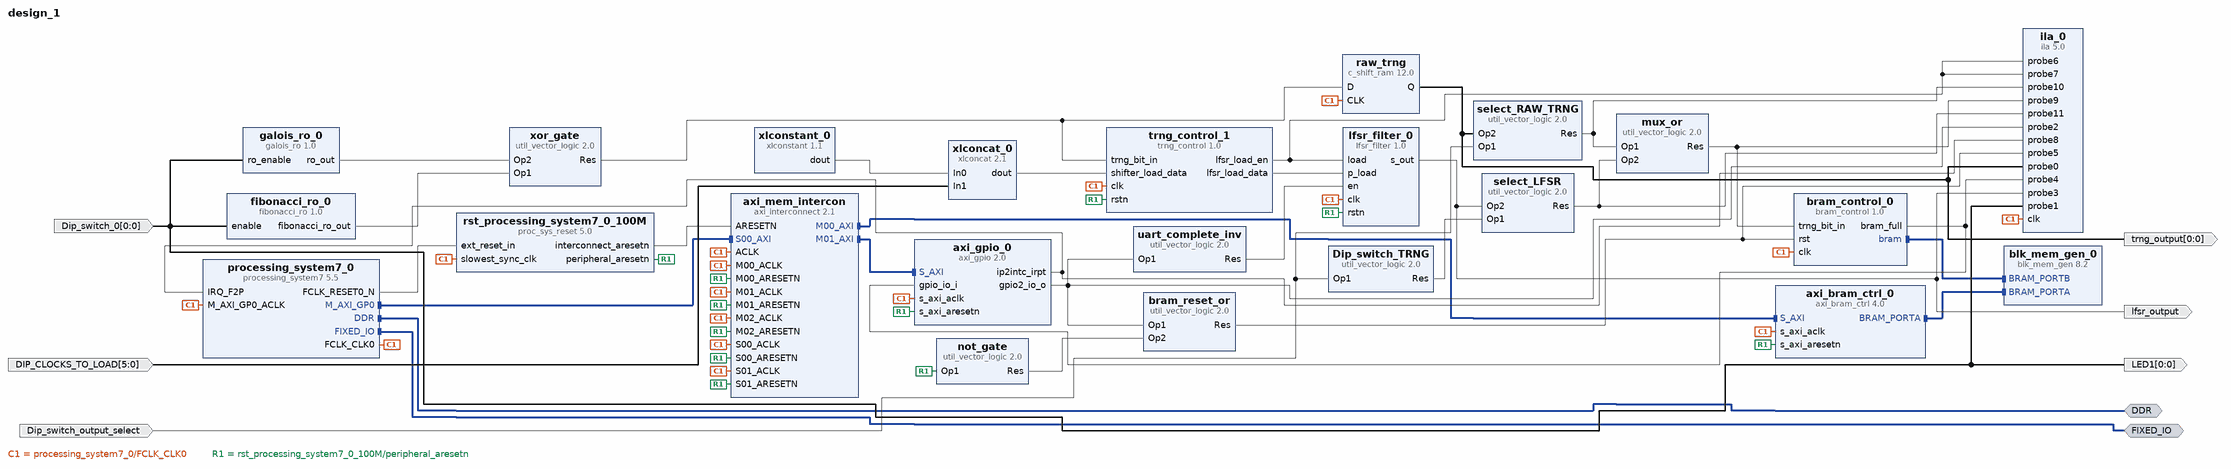
[diagram p0: block diagram of the top level]
# Vivado block design design_1, Vivado 2014.4
create_bd_design design_1

create_bd_intf_port -mode Master -vlnv xilinx.com:interface:ddrx_rtl:1.0 DDR
create_bd_intf_port -mode Master -vlnv xilinx.com:display_processing_system7:fixedio_rtl:1.0 FIXED_IO
create_bd_port -dir O -from 0 -to 0 -type data trng_output
create_bd_port -dir I -from 0 -to 0 Dip_switch_0
create_bd_port -dir O -from 0 -to 0 LED1
create_bd_port -dir I Dip_switch_output_select
create_bd_port -dir O lfsr_output
create_bd_port -dir I -from 5 -to 0 DIP_CLOCKS_TO_LOAD

create_bd_cell -type ip -vlnv xilinx.com:ip:processing_system7:5.5 processing_system7_0
set_property -dict [list \
  CONFIG.PCW_FPGA0_PERIPHERAL_FREQMHZ 100.000000 \
  CONFIG.PCW_USE_FABRIC_INTERRUPT 1 \
  CONFIG.PCW_IRQ_F2P_INTR 1 \
  CONFIG.preset {ZedBoard*} \
] [get_bd_cells processing_system7_0]
create_bd_cell -type ip -vlnv xilinx.com:ip:axi_interconnect:2.1 axi_mem_intercon
set_property -dict {CONFIG.NUM_SI 2 CONFIG.NUM_MI 3} [get_bd_cells axi_mem_intercon]
create_bd_cell -type ip -vlnv xilinx.com:ip:proc_sys_reset:5.0 rst_processing_system7_0_100M
create_bd_cell -type ip -vlnv user.org:user:lfsr_filter:1.0 lfsr_filter_0
create_bd_cell -type ip -vlnv user.org:user:bram_control:1.0 bram_control_0
set_property -dict {CONFIG.BRAM_DEPTH 2048} [get_bd_cells bram_control_0]
create_bd_cell -type ip -vlnv xilinx.com:ip:util_vector_logic:2.0 not_gate
set_property -dict {CONFIG.C_SIZE 1 CONFIG.C_OPERATION not} [get_bd_cells not_gate]
create_bd_cell -type ip -vlnv xilinx.com:ip:util_vector_logic:2.0 xor_gate
set_property -dict {CONFIG.C_SIZE 1 CONFIG.C_OPERATION xor} [get_bd_cells xor_gate]
create_bd_cell -type ip -vlnv xilinx.com:ip:axi_gpio:2.0 axi_gpio_0
set_property -dict [list \
  CONFIG.C_GPIO_WIDTH 1 \
  CONFIG.C_GPIO2_WIDTH 1 \
  CONFIG.C_IS_DUAL 1 \
  CONFIG.C_ALL_INPUTS 1 \
  CONFIG.C_DOUT_DEFAULT_2 0x00000000 \
  CONFIG.C_INTERRUPT_PRESENT 1 \
  CONFIG.C_ALL_OUTPUTS_2 1 \
] [get_bd_cells axi_gpio_0]
create_bd_cell -type ip -vlnv xilinx.com:ip:c_shift_ram:12.0 raw_trng
set_property -dict {CONFIG.Width 1 CONFIG.Depth 1 CONFIG.DefaultData 0 CONFIG.AsyncInitVal 0} [get_bd_cells raw_trng]
create_bd_cell -type ip -vlnv xilinx.com:ip:ila:5.0 ila_0
set_property -dict [list \
  CONFIG.C_PROBE12_WIDTH 1 \
  CONFIG.C_PROBE7_WIDTH 1 \
  CONFIG.C_NUM_OF_PROBES 12 \
  CONFIG.C_EN_STRG_QUAL 1 \
  CONFIG.C_INPUT_PIPE_STAGES 2 \
  CONFIG.C_ADV_TRIGGER true \
  CONFIG.C_PROBE14_MU_CNT 2 \
  CONFIG.C_PROBE13_MU_CNT 2 \
  CONFIG.C_PROBE12_MU_CNT 2 \
  CONFIG.C_PROBE11_MU_CNT 2 \
  CONFIG.C_PROBE10_MU_CNT 2 \
  CONFIG.C_PROBE9_MU_CNT 2 \
  CONFIG.C_PROBE8_MU_CNT 2 \
  CONFIG.C_PROBE7_MU_CNT 2 \
  CONFIG.C_PROBE6_MU_CNT 2 \
  CONFIG.C_PROBE5_MU_CNT 2 \
  CONFIG.C_PROBE4_MU_CNT 2 \
  CONFIG.C_PROBE3_MU_CNT 2 \
  CONFIG.C_PROBE2_MU_CNT 2 \
  CONFIG.C_PROBE1_MU_CNT 2 \
  CONFIG.C_PROBE0_MU_CNT 2 \
  CONFIG.ALL_PROBE_SAME_MU_CNT 2 \
  CONFIG.C_ENABLE_ILA_AXI_MON false \
  CONFIG.C_MONITOR_TYPE Native \
] [get_bd_cells ila_0]
create_bd_cell -type ip -vlnv user.org:user:fibonacci_ro:1.0 fibonacci_ro_0
create_bd_cell -type ip -vlnv user.org:user:galois_ro:1.0 galois_ro_0
create_bd_cell -type ip -vlnv xilinx.com:ip:blk_mem_gen:8.2 blk_mem_gen_0
set_property -dict [list \
  CONFIG.Memory_Type True_Dual_Port_RAM \
  CONFIG.Enable_B Use_ENB_Pin \
  CONFIG.Use_RSTB_Pin true \
  CONFIG.Port_B_Clock 100 \
  CONFIG.Port_B_Write_Rate 50 \
  CONFIG.Port_B_Enable_Rate 100 \
] [get_bd_cells blk_mem_gen_0]
create_bd_cell -type ip -vlnv xilinx.com:ip:axi_bram_ctrl:4.0 axi_bram_ctrl_0
set_property -dict {CONFIG.SINGLE_PORT_BRAM 1} [get_bd_cells axi_bram_ctrl_0]
create_bd_cell -type ip -vlnv xilinx.com:ip:util_vector_logic:2.0 Dip_switch_TRNG
set_property -dict {CONFIG.C_SIZE 1 CONFIG.C_OPERATION not} [get_bd_cells Dip_switch_TRNG]
create_bd_cell -type ip -vlnv xilinx.com:ip:util_vector_logic:2.0 select_LFSR
set_property -dict {CONFIG.C_SIZE 1} [get_bd_cells select_LFSR]
create_bd_cell -type ip -vlnv xilinx.com:ip:util_vector_logic:2.0 select_RAW_TRNG
set_property -dict {CONFIG.C_SIZE 1} [get_bd_cells select_RAW_TRNG]
create_bd_cell -type ip -vlnv xilinx.com:ip:util_vector_logic:2.0 mux_or
set_property -dict {CONFIG.C_SIZE 1 CONFIG.C_OPERATION or} [get_bd_cells mux_or]
create_bd_cell -type ip -vlnv xilinx.com:ip:util_vector_logic:2.0 uart_complete_inv
set_property -dict {CONFIG.C_SIZE 1 CONFIG.C_OPERATION not} [get_bd_cells uart_complete_inv]
create_bd_cell -type ip -vlnv xilinx.com:ip:util_vector_logic:2.0 bram_reset_or
set_property -dict {CONFIG.C_SIZE 1 CONFIG.C_OPERATION or} [get_bd_cells bram_reset_or]
create_bd_cell -type ip -vlnv user.org:user:trng_control:1.0 trng_control_1
create_bd_cell -type ip -vlnv xilinx.com:ip:xlconstant:1.1 xlconstant_0
set_property -dict {CONFIG.CONST_WIDTH 10 CONFIG.CONST_VAL 1023} [get_bd_cells xlconstant_0]
create_bd_cell -type ip -vlnv xilinx.com:ip:xlconcat:2.1 xlconcat_0
set_property -dict {CONFIG.IN0_WIDTH 10 CONFIG.IN1_WIDTH 6} [get_bd_cells xlconcat_0]

# ---- connections ----

connect_bd_intf_net [get_bd_intf_pins processing_system7_0/M_AXI_GP0] [get_bd_intf_pins axi_mem_intercon/S00_AXI]
connect_bd_intf_net [get_bd_intf_pins axi_mem_intercon/M01_AXI] [get_bd_intf_pins axi_gpio_0/S_AXI]
connect_bd_intf_net [get_bd_intf_pins axi_bram_ctrl_0/BRAM_PORTA] [get_bd_intf_pins blk_mem_gen_0/BRAM_PORTA]
connect_bd_intf_net [get_bd_intf_pins bram_control_0/bram] [get_bd_intf_pins blk_mem_gen_0/BRAM_PORTB]
connect_bd_intf_net [get_bd_intf_pins axi_mem_intercon/M00_AXI] [get_bd_intf_pins axi_bram_ctrl_0/S_AXI]
connect_bd_intf_net [get_bd_intf_ports DDR] [get_bd_intf_pins processing_system7_0/DDR]
connect_bd_intf_net [get_bd_intf_ports FIXED_IO] [get_bd_intf_pins processing_system7_0/FIXED_IO]
connect_bd_net [get_bd_pins processing_system7_0/FCLK_CLK0] \
  [get_bd_pins processing_system7_0/M_AXI_GP0_ACLK] [get_bd_pins rst_processing_system7_0_100M/slowest_sync_clk] \
  [get_bd_pins lfsr_filter_0/clk] [get_bd_pins bram_control_0/clk] [get_bd_pins axi_gpio_0/s_axi_aclk] \
  [get_bd_pins raw_trng/CLK] [get_bd_pins ila_0/clk] [get_bd_pins axi_bram_ctrl_0/s_axi_aclk] \
  [get_bd_pins axi_mem_intercon/S00_ACLK] [get_bd_pins axi_mem_intercon/ACLK] [get_bd_pins axi_mem_intercon/M00_ACLK] \
  [get_bd_pins axi_mem_intercon/M01_ACLK] [get_bd_pins axi_mem_intercon/M02_ACLK] [get_bd_pins axi_mem_intercon/S01_ACLK] \
  [get_bd_pins trng_control_1/clk]
connect_bd_net [get_bd_pins processing_system7_0/FCLK_RESET0_N] [get_bd_pins rst_processing_system7_0_100M/ext_reset_in]
connect_bd_net [get_bd_pins rst_processing_system7_0_100M/peripheral_aresetn] \
  [get_bd_pins lfsr_filter_0/rstn] [get_bd_pins not_gate/Op1] [get_bd_pins axi_gpio_0/s_axi_aresetn] \
  [get_bd_pins axi_bram_ctrl_0/s_axi_aresetn] [get_bd_pins axi_mem_intercon/S00_ARESETN] \
  [get_bd_pins axi_mem_intercon/M00_ARESETN] [get_bd_pins axi_mem_intercon/M01_ARESETN] \
  [get_bd_pins axi_mem_intercon/M02_ARESETN] [get_bd_pins axi_mem_intercon/S01_ARESETN] [get_bd_pins trng_control_1/rstn]
connect_bd_net [get_bd_pins rst_processing_system7_0_100M/interconnect_aresetn] [get_bd_pins axi_mem_intercon/ARESETN]
connect_bd_net [get_bd_pins xor_gate/Res] [get_bd_pins raw_trng/D] [get_bd_pins trng_control_1/trng_bit_in]
connect_bd_net -net trng_control_0_lfsr_load_en [get_bd_pins trng_control_1/lfsr_load_en] \
  [get_bd_pins lfsr_filter_0/load] [get_bd_pins ila_0/probe6] [get_bd_pins ila_0/probe7]
connect_bd_net [get_bd_pins bram_control_0/bram_full] [get_bd_pins axi_gpio_0/gpio_io_i] [get_bd_pins ila_0/probe4]
connect_bd_net [get_bd_pins axi_gpio_0/gpio2_io_o] [get_bd_pins ila_0/probe2] [get_bd_pins uart_complete_inv/Op1] [get_bd_pins bram_reset_or/Op1]
connect_bd_net [get_bd_pins axi_gpio_0/ip2intc_irpt] [get_bd_pins processing_system7_0/IRQ_F2P] [get_bd_pins ila_0/probe8]
connect_bd_net -net c_shift_ram_0_Q [get_bd_pins raw_trng/Q] [get_bd_ports trng_output] [get_bd_pins ila_0/probe0] [get_bd_pins select_RAW_TRNG/Op2]
connect_bd_net -net Op1_1 [get_bd_ports Dip_switch_0] \
  [get_bd_ports LED1] [get_bd_pins ila_0/probe1] [get_bd_pins galois_ro_0/ro_enable] [get_bd_pins fibonacci_ro_0/enable]
connect_bd_net [get_bd_pins fibonacci_ro_0/fibonacci_ro_out] [get_bd_pins xor_gate/Op1]
connect_bd_net [get_bd_pins galois_ro_0/ro_out] [get_bd_pins xor_gate/Op2]
connect_bd_net [get_bd_ports Dip_switch_output_select] [get_bd_pins Dip_switch_TRNG/Op1] [get_bd_pins select_RAW_TRNG/Op1]
connect_bd_net -net util_vector_logic_0_Res1 [get_bd_pins Dip_switch_TRNG/Res] [get_bd_pins select_LFSR/Op1]
connect_bd_net -net util_vector_logic_2_Res [get_bd_pins select_RAW_TRNG/Res] [get_bd_pins mux_or/Op1] [get_bd_pins ila_0/probe10]
connect_bd_net -net util_vector_logic_1_Res [get_bd_pins select_LFSR/Res] [get_bd_pins mux_or/Op2] [get_bd_pins ila_0/probe11]
connect_bd_net -net util_vector_logic_3_Res [get_bd_pins mux_or/Res] [get_bd_pins bram_control_0/trng_bit_in] [get_bd_pins ila_0/probe9]
connect_bd_net -net util_vector_logic_4_Res [get_bd_pins uart_complete_inv/Res] [get_bd_pins lfsr_filter_0/en]
connect_bd_net -net util_vector_logic_5_Res [get_bd_pins bram_reset_or/Res] [get_bd_pins bram_control_0/rst] [get_bd_pins ila_0/probe5]
connect_bd_net [get_bd_pins not_gate/Res] [get_bd_pins bram_reset_or/Op2]
connect_bd_net [get_bd_pins lfsr_filter_0/s_out] [get_bd_ports lfsr_output] [get_bd_pins select_LFSR/Op2] [get_bd_pins ila_0/probe3]
connect_bd_net [get_bd_ports DIP_CLOCKS_TO_LOAD] [get_bd_pins xlconcat_0/In1]
connect_bd_net [get_bd_pins xlconstant_0/dout] [get_bd_pins xlconcat_0/In0]
connect_bd_net [get_bd_pins xlconcat_0/dout] [get_bd_pins trng_control_1/shifter_load_data]
connect_bd_net [get_bd_pins trng_control_1/lfsr_load_data] [get_bd_pins lfsr_filter_0/p_load]

# ---- address map ----
assign_bd_address -offset 0x40000000 -range 8K -target_address_space [get_bd_addr_spaces processing_system7_0/Data] [get_bd_addr_segs axi_bram_ctrl_0/S_AXI/Mem0]
assign_bd_address -offset 0x41200000 -range 64K -target_address_space [get_bd_addr_spaces processing_system7_0/Data] [get_bd_addr_segs axi_gpio_0/S_AXI/Reg]

validate_bd_design
save_bd_design
